# Altium schematic sheet 08_SAMA7G54-PIO.SchDoc
size 420 x 297 mm; SheetNumber: 15; SheetTotal: 33
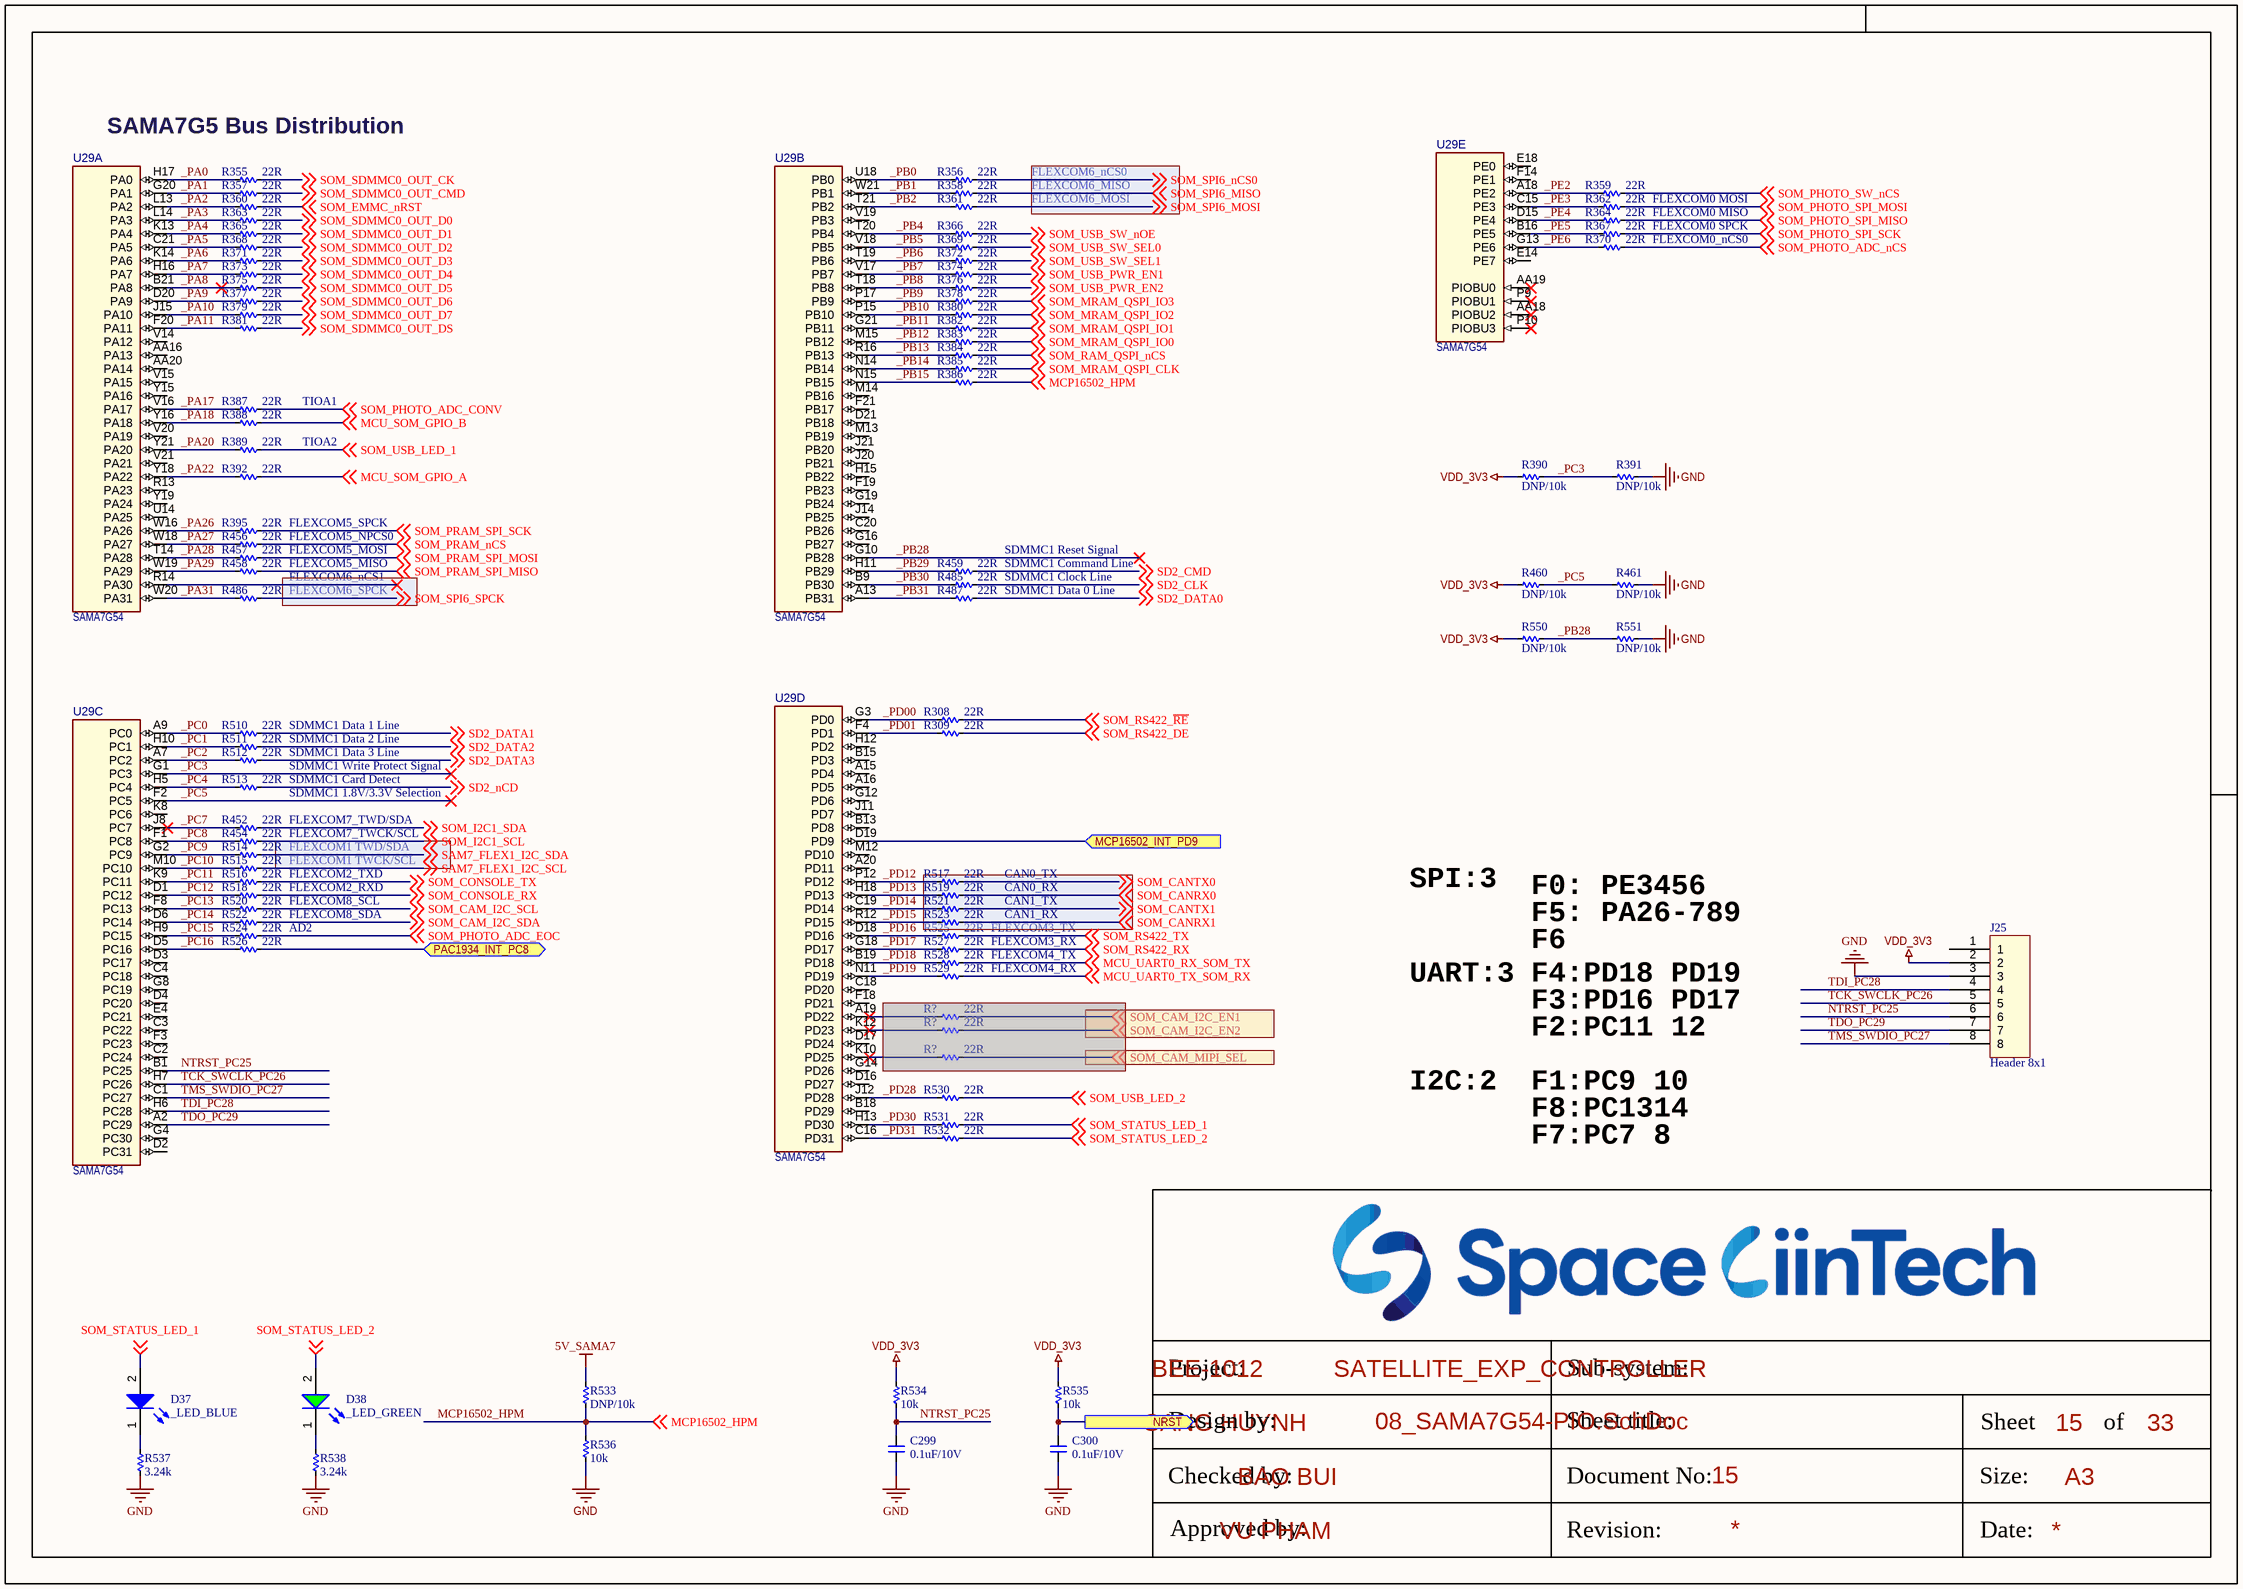
[diagram p0: 08_SAMA7G54-PIO.SchDoc]

## Parts
(Parts that share a designator on the sheet are numbered #1, #2 ... from top to bottom, then left to right.)
C299  0.1uF/10V  [CAP_C_0603x30]
C300  0.1uF/10V  [CAP_C_0603x30]
D37  _LED_BLUE  [LED_0402]
D38  _LED_GREEN  [LED_0402]
J25  Header 8x1  [SAMTEC_TSM-108-01-L-SV-P-TR]
R308  22R  [RES_C_0603X30]
R309  22R  [RES_C_0603X30]
R355  22R  [RES_C_0603X30]
R356  22R  [RES_C_0603X30]
R357  22R  [RES_C_0603X30]
R358  22R  [RES_C_0603X30]
R359  22R  [RES_C_0603X30]
R360  22R  [RES_C_0603X30]
R361  22R  [RES_C_0603X30]
R362  22R  [RES_C_0603X30]
R363  22R  [RES_C_0603X30]
R364  22R  [RES_C_0603X30]
R365  22R  [RES_C_0603X30]
R366  22R  [RES_C_0603X30]
R367  22R  [RES_C_0603X30]
R368  22R  [RES_C_0603X30]
R369  22R  [RES_C_0603X30]
R370  22R  [RES_C_0603X30]
R371  22R  [RES_C_0603X30]
R372  22R  [RES_C_0603X30]
R373  22R  [RES_C_0603X30]
R374  22R  [RES_C_0603X30]
R375  22R  [RES_C_0603X30]
R376  22R  [RES_C_0603X30]
R377  22R  [RES_C_0603X30]
R378  22R  [RES_C_0603X30]
R379  22R  [RES_C_0603X30]
R380  22R  [RES_C_0603X30]
R381  22R  [RES_C_0603X30]
R382  22R  [RES_C_0603X30]
R383  22R  [RES_C_0603X30]
R384  22R  [RES_C_0603X30]
R385  22R  [RES_C_0603X30]
R386  22R  [RES_C_0603X30]
R387  22R  [RES_C_0603X30]
R388  22R  [RES_C_0603X30]
R389  22R  [RES_C_0603X30]
R390  DNP/10k  [RES_C_0603X30]
R391  DNP/10k  [RES_C_0603X30]
R392  22R  [RES_C_0603X30]
R395  22R  [RES_C_0603X30]
R452  22R  [RES_C_0603X30]
R454  22R  [RES_C_0603X30]
R456  22R  [RES_C_0603X30]
R457  22R  [RES_C_0603X30]
R458  22R  [RES_C_0603X30]
R459  22R  [RES_C_0603X30]
R460  DNP/10k  [RES_C_0603X30]
R461  DNP/10k  [RES_C_0603X30]
R485  22R  [RES_C_0603X30]
R486  22R  [RES_C_0603X30]
R487  22R  [RES_C_0603X30]
R510  22R  [RES_C_0603X30]
R511  22R  [RES_C_0603X30]
R512  22R  [RES_C_0603X30]
R513  22R  [RES_C_0603X30]
R514  22R  [RES_C_0603X30]
R515  22R  [RES_C_0603X30]
R516  22R  [RES_C_0603X30]
R517  22R  [RES_C_0603X30]
R518  22R  [RES_C_0603X30]
R519  22R  [RES_C_0603X30]
R520  22R  [RES_C_0603X30]
R521  22R  [RES_C_0603X30]
R522  22R  [RES_C_0603X30]
R523  22R  [RES_C_0603X30]
R524  22R  [RES_C_0603X30]
R525  22R  [RES_C_0603X30]
R526  22R  [RES_C_0603X30]
R527  22R  [RES_C_0603X30]
R528  22R  [RES_C_0603X30]
R529  22R  [RES_C_0603X30]
R530  22R  [RES_C_0603X30]
R531  22R  [RES_C_0603X30]
R532  22R  [RES_C_0603X30]
R533  DNP/10k  [RES_C_0603X30]
R534  10k  [RES_C_0603X30]
R535  10k  [RES_C_0603X30]
R536  10k  [RES_C_0603X30]
R537  3.24k  [RES_C_1005x30_L]
R538  3.24k  [RES_C_1005x30_L]
R550  DNP/10k  [RES_C_0603X30]
R551  DNP/10k  [RES_C_0603X30]
R?#1  22R  [RES_C_0603X30]  (masked out: inside a compile mask, not in the netlist)
R?#2  22R  [RES_C_0603X30]  (masked out: inside a compile mask, not in the netlist)
R?#3  22R  [RES_C_0603X30]  (masked out: inside a compile mask, not in the netlist)
U29  SAMA7G54  [TFBGA-343_14x14 - 2.5mm]  (parts A,B,C,D,E of 8)

## Ports
MCP16502_INT_PD9 (in), NRST (out), PAC1934_INT_PC8 (bidir)

## Nets
5V_SAMA7: R533.1
GND: C299.1 C300.1 J25.3 R391.1 R461.1 R536.2 R537.2 R538.2 R551.1
VDD_3V3: J25.2 R390.2 R460.2 R534.2 R535.2 R550.2
_PA0: R355.2 U29.H17(PA0)
_PA1: R357.2 U29.G20(PA1)
_PA2: R360.2 U29.L13(PA2)
_PA3: R363.2 U29.L14(PA3)
_PA4: R365.2 U29.K13(PA4)
_PA5: R368.2 U29.C21(PA5)
_PA6: R371.2 U29.K14(PA6)
_PA7: R373.2 U29.H16(PA7)
_PA8: R375.2 U29.B21(PA8)
_PA9: R377.2 U29.D20(PA9)
_PA10: R379.2 U29.J15(PA10)
_PA11: R381.2 U29.F20(PA11)
_PA17: R387.2 U29.V16(PA17)
_PA18: R388.2 U29.Y16(PA18)
_PA20: R389.2 U29.Y21(PA20)
_PA22: R392.2 U29.Y18(PA22)
_PA26: R395.2 U29.W16(PA26)
_PA27: R456.2 U29.W18(PA27)
_PA28: R457.2 U29.T14(PA28)
_PA29: R458.2 U29.W19(PA29)
_PA31: R486.2 U29.W20(PA31)
_PB0: R356.2 U29.U18(PB0)
_PB1: R358.2 U29.W21(PB1)
_PB2: R361.2 U29.T21(PB2)
_PB4: R366.2 U29.T20(PB4)
_PB5: R369.2 U29.V18(PB5)
_PB6: R372.2 U29.T19(PB6)
_PB7: R374.2 U29.V17(PB7)
_PB8: R376.2 U29.T18(PB8)
_PB9: R378.2 U29.P17(PB9)
_PB10: R380.2 U29.P15(PB10)
_PB11: R382.2 U29.G21(PB11)
_PB12: R383.2 U29.M15(PB12)
_PB13: R384.2 U29.R16(PB13)
_PB14: R385.2 U29.N14(PB14)
_PB15: R386.2 U29.N15(PB15)
_PB28: R550.1 R551.2 U29.G10(PB28)
_PB29: R459.2 U29.H11(PB29)
_PB30: R485.2 U29.B9(PB30)
_PB31: R487.2 U29.A13(PB31)
_PC0: R510.2 U29.A9(PC0)
_PC1: R511.2 U29.H10(PC1)
_PC2: R512.2 U29.A7(PC2)
_PC3: R390.1 R391.2 U29.G1(PC3)
_PC4: R513.2 U29.H5(PC4)
_PC5: R460.1 R461.2 U29.F2(PC5)
_PC7: R452.2 U29.J8(PC7)
_PC8: R454.2 U29.F1(PC8)
_PC9: R514.2 U29.G2(PC9)
_PC10: R515.2 U29.M10(PC10)
_PC11: R516.2 U29.K9(PC11)
_PC12: R518.2 U29.D1(PC12)
_PC13: R520.2 U29.F8(PC13)
_PC14: R522.2 U29.D6(PC14)
_PC15: R524.2 U29.H9(PC15)
_PC16: R526.2 U29.D5(PC16)
_PD00: R308.2 U29.G3(PD0)
_PD01: R309.2 U29.F4(PD1)
_PD12: R517.2 U29.P12(PD12)
_PD13: R519.2 U29.H18(PD13)
_PD14: R521.2 U29.C19(PD14)
_PD15: R523.2 U29.R12(PD15)
_PD16: R525.2 U29.D18(PD16)
_PD17: R527.2 U29.G18(PD17)
_PD18: R528.2 U29.B19(PD18)
_PD19: R529.2 U29.N11(PD19)
_PD28: R530.2 U29.J12(PD28)
_PD30: R531.2 U29.H13(PD30)
_PD31: R532.2 U29.C16(PD31)
_PE2: R359.2 U29.A18(PE2)
_PE3: R362.2 U29.C15(PE3)
_PE4: R364.2 U29.D15(PE4)
_PE5: R367.2 U29.B16(PE5)
_PE6: R370.2 U29.G13(PE6)
MCP16502_HPM: R386.1 R533.2 R536.1 ; off-sheet MCP16502_HPM
MCP16502_INT_PD9: U29.D19(PD9) ; port MCP16502_INT_PD9
MCU_SOM_GPIO_A: R392.1 ; off-sheet MCU_SOM_GPIO_A
MCU_SOM_GPIO_B: R388.1 ; off-sheet MCU_SOM_GPIO_B
MCU_UART0_RX_SOM_TX: R528.1 ; off-sheet MCU_UART0_RX_SOM_TX
MCU_UART0_TX_SOM_RX: R529.1 ; off-sheet MCU_UART0_TX_SOM_RX
NRST: C300.2 R535.1 ; port NRST
NTRST_PC25: C299.2 J25.6 R534.1 U29.B1(PC25)
PAC1934_INT_PC8: R526.1 ; port PAC1934_INT_PC8
SAM7_FLEX1_I2C_SCL: R515.1 ; off-sheet SAM7_FLEX1_I2C_SCL
SAM7_FLEX1_I2C_SDA: R514.1 ; off-sheet SAM7_FLEX1_I2C_SDA
SD2_CLK: R485.1 ; off-sheet SD2_CLK
SD2_CMD: R459.1 ; off-sheet SD2_CMD
SD2_DATA0: R487.1 ; off-sheet SD2_DATA0
SD2_DATA1: R510.1 ; off-sheet SD2_DATA1
SD2_DATA2: R511.1 ; off-sheet SD2_DATA2
SD2_DATA3: R512.1 ; off-sheet SD2_DATA3
SD2_nCD: R513.1 ; off-sheet SD2_nCD
SOM_CAM_I2C_SCL: R520.1 ; off-sheet SOM_CAM_I2C_SCL
SOM_CAM_I2C_SDA: R522.1 ; off-sheet SOM_CAM_I2C_SDA
SOM_CANRX0: R519.1 ; off-sheet SOM_CANRX0
SOM_CANRX1: R523.1 ; off-sheet SOM_CANRX1
SOM_CANTX0: R517.1 ; off-sheet SOM_CANTX0
SOM_CANTX1: R521.1 ; off-sheet SOM_CANTX1
SOM_CONSOLE_RX: R518.1 ; off-sheet SOM_CONSOLE_RX
SOM_CONSOLE_TX: R516.1 ; off-sheet SOM_CONSOLE_TX
SOM_EMMC_nRST: R360.1 ; off-sheet SOM_EMMC_nRST
SOM_I2C1_SCL: R454.1 ; off-sheet SOM_I2C1_SCL
SOM_I2C1_SDA: R452.1 ; off-sheet SOM_I2C1_SDA
SOM_MRAM_QSPI_CLK: R385.1 ; off-sheet SOM_MRAM_QSPI_CLK
SOM_MRAM_QSPI_IO0: R383.1 ; off-sheet SOM_MRAM_QSPI_IO0
SOM_MRAM_QSPI_IO1: R382.1 ; off-sheet SOM_MRAM_QSPI_IO1
SOM_MRAM_QSPI_IO2: R380.1 ; off-sheet SOM_MRAM_QSPI_IO2
SOM_MRAM_QSPI_IO3: R378.1 ; off-sheet SOM_MRAM_QSPI_IO3
SOM_PHOTO_ADC_CONV: R387.1 ; off-sheet SOM_PHOTO_ADC_CONV
SOM_PHOTO_ADC_EOC: R524.1 ; off-sheet SOM_PHOTO_ADC_EOC
SOM_PHOTO_ADC_nCS: R370.1 ; off-sheet SOM_PHOTO_ADC_nCS
SOM_PHOTO_SPI_MISO: R364.1 ; off-sheet SOM_PHOTO_SPI_MISO
SOM_PHOTO_SPI_MOSI: R362.1 ; off-sheet SOM_PHOTO_SPI_MOSI
SOM_PHOTO_SPI_SCK: R367.1 ; off-sheet SOM_PHOTO_SPI_SCK
SOM_PHOTO_SW_nCS: R359.1 ; off-sheet SOM_PHOTO_SW_nCS
SOM_PRAM_nCS: R456.1 ; off-sheet SOM_PRAM_nCS
SOM_PRAM_SPI_MISO: R458.1 ; off-sheet SOM_PRAM_SPI_MISO
SOM_PRAM_SPI_MOSI: R457.1 ; off-sheet SOM_PRAM_SPI_MOSI
SOM_PRAM_SPI_SCK: R395.1 ; off-sheet SOM_PRAM_SPI_SCK
SOM_RAM_QSPI_nCS: R384.1 ; off-sheet SOM_RAM_QSPI_nCS
SOM_RS422_DE: R309.1 ; off-sheet SOM_RS422_DE
SOM_RS422_~{RE}: R308.1 ; off-sheet SOM_RS422_~{RE}
SOM_RS422_RX: R527.1 ; off-sheet SOM_RS422_RX
SOM_RS422_TX: R525.1 ; off-sheet SOM_RS422_TX
SOM_SDMMC0_OUT_CK: R355.1 ; off-sheet SOM_SDMMC0_OUT_CK
SOM_SDMMC0_OUT_CMD: R357.1 ; off-sheet SOM_SDMMC0_OUT_CMD
SOM_SDMMC0_OUT_D0: R363.1 ; off-sheet SOM_SDMMC0_OUT_D0
SOM_SDMMC0_OUT_D1: R365.1 ; off-sheet SOM_SDMMC0_OUT_D1
SOM_SDMMC0_OUT_D2: R368.1 ; off-sheet SOM_SDMMC0_OUT_D2
SOM_SDMMC0_OUT_D3: R371.1 ; off-sheet SOM_SDMMC0_OUT_D3
SOM_SDMMC0_OUT_D4: R373.1 ; off-sheet SOM_SDMMC0_OUT_D4
SOM_SDMMC0_OUT_D5: R375.1 ; off-sheet SOM_SDMMC0_OUT_D5
SOM_SDMMC0_OUT_D6: R377.1 ; off-sheet SOM_SDMMC0_OUT_D6
SOM_SDMMC0_OUT_D7: R379.1 ; off-sheet SOM_SDMMC0_OUT_D7
SOM_SDMMC0_OUT_DS: R381.1 ; off-sheet SOM_SDMMC0_OUT_DS
SOM_SPI6_MISO: R358.1 ; off-sheet SOM_SPI6_MISO
SOM_SPI6_MOSI: R361.1 ; off-sheet SOM_SPI6_MOSI
SOM_SPI6_nCS0: R356.1 ; off-sheet SOM_SPI6_nCS0
SOM_SPI6_SPCK: R486.1 ; off-sheet SOM_SPI6_SPCK
SOM_STATUS_LED_1: D37.2(A) R531.1 ; off-sheet SOM_STATUS_LED_1
SOM_STATUS_LED_2: D38.2(A) R532.1 ; off-sheet SOM_STATUS_LED_2
SOM_USB_LED_1: R389.1 ; off-sheet SOM_USB_LED_1
SOM_USB_LED_2: R530.1 ; off-sheet SOM_USB_LED_2
SOM_USB_PWR_EN1: R374.1 ; off-sheet SOM_USB_PWR_EN1
SOM_USB_PWR_EN2: R376.1 ; off-sheet SOM_USB_PWR_EN2
SOM_USB_SW_nOE: R366.1 ; off-sheet SOM_USB_SW_nOE
SOM_USB_SW_SEL0: R369.1 ; off-sheet SOM_USB_SW_SEL0
SOM_USB_SW_SEL1: R372.1 ; off-sheet SOM_USB_SW_SEL1
TCK_SWCLK_PC26: J25.5 U29.H7(PC26)
TDI_PC28: J25.4 U29.H6(PC28)
TDO_PC29: J25.7 U29.A2(PC29)
TMS_SWDIO_PC27: J25.8 U29.C1(PC27)
NetD37_1: D37.1(K) R537.1
NetD38_1: D38.1(K) R538.1

Not connected (* = marked no-connect by the designer): J25 1; U29 A15(PD4) A16(PD5) A19(PD22)* A20(PD11) AA16(PA13) AA18(PIOBU2)* AA19(PIOBU0)* AA20(PA14) B13(PD8) B15(PD3) B18(PD29) C2(PC24) C3(PC22) C4(PC18) C18(PD20) C20(PB26) D2(PC31) D3(PC17) D4(PC20) D16(PD27) D17(PD24) D21(PB18) E4(PC21) E14(PE7) E18(PE0) F3(PC23) F14(PE1) F18(PD21) F19(PB23) F21(PB17) G4(PC30) G8(PC19) G12(PD6) G14(PD26) G16(PB27) G19(PB24) H12(PD2) H15(PB22) J11(PD7) J14(PB25) J20(PB21) J21(PB20) K8(PC6) K10(PD25)* K12(PD23)* M12(PD10) M13(PB19) M14(PB16) P9(PIOBU1)* P10(PIOBU3)* R13(PA23) R14(PA30)* U14(PA25) V14(PA12) V15(PA15) V19(PB3) V20(PA19) V21(PA21) Y15(PA16) Y19(PA24)

## Notes on the sheet
- SAMA7G5 Bus Distribution
- FLEXCOM6_MISO
- FLEXCOM6_nCS0
- FLEXCOM6_MOSI
- FLEXCOM0 MISO
- FLEXCOM0_nCS0
- FLEXCOM0 SPCK
- FLEXCOM0 MOSI
- TIOA1
- TIOA2
- FLEXCOM5_SPCK
- FLEXCOM6_SPCK
- FLEXCOM6_nCS1
- FLEXCOM5_NPCS0
- FLEXCOM5_MOSI
- FLEXCOM5_MISO
- SDMMC1 Reset Signal
- SDMMC1 Command Line
- SDMMC1 Data 0 Line
- SDMMC1 Clock Line
- SDMMC1 Data 1 Line
- SDMMC1 Data 2 Line
- SDMMC1 Data 3 Line
- SDMMC1 Write Protect Signal
- SDMMC1 Card Detect
- SDMMC1 1.8V/3.3V Selection
- FLEXCOM1 TWD/SDA
- FLEXCOM1 TWCK/SCL
- FLEXCOM7_TWD/SDA
- FLEXCOM7_TWCK/SCL
- AD2
- FLEXCOM8_SCL
- FLEXCOM8_SDA
- FLEXCOM2_TXD
- FLEXCOM2_RXD
- FLEXCOM3_TX
- CAN0_TX
- CAN0_RX
- CAN1_TX
- CAN1_RX
- SPI:3
- F0: PE3456
- F5: PA26-789
- FLEXCOM3_RX
- FLEXCOM4_TX
- FLEXCOM4_RX
- UART:3
- F4:PD18 PD19
- F6
- F3:PD16 PD17
- F2:PC11 12
- I2C:2
- F1:PC9 10
- F8:PC1314
- F7:PC7 8
- Project:
- BEE-1012
- Sub-system:
- SATELLITE_EXP_CONTROLLER
- Design by:
- SANG HUYNH
- BAO BUI
- Sheet title:
- Sheet
- A3
- of
- Checked by:
- Approved by:
- VU PHAM
- Revision:
- Document No:
- Size:
- Date:

## Library data of the parts
C299 C300 = _CAP_C_2: CAP
R308 R309 R355-R392 R395 R452 R454 R456-R461 R485-R487 R510-R538 R550 R551 R?#1-R?#3 = _RES_B_2: RES
U29 = SAMA7G54: SAMA7G54 MPU 1000MHz Cortex-A7 TFBGA-343; Manufacturer Part Number 1: SAMA7G54-V/4HB; Manufacturer 1: Microchip; Description_: MCHP MPU 32-BIT Cortex-A7 1000MHz 128kB SAMA7G54-V/4HB TFBGA-343; Populated: YES; MCHP-ID: MIC8923; Symbol: SAMA7G54 TFBGA-343; Dev Tools Status: Design; Owner: Ciprian Abramov; Package: TFBGA-343; Value: SAMA7G54; Type: 32-Bit MPU; Status: MCL Design; Revision: 1; Category: MCHP-Microcontroller; ComponentLink1Description: SVN Datasheet; ComponentLink2Description: Local Datasheet; ComponentLink3URL: C:\ALTIUM_WORK\00001_MCHP-CDB\Library\LibraryRefs\SAMA7G54 TFBGA-343.SchLib; ComponentLink3Description: Open Symbol; ComponentLink4URL: C:\ALTIUM_WORK\00001_MCHP-CDB\Library\Footprints\TFBGA-343_14x14.PcbLib; ComponentLink4Description: Open Footprint; ComponentLink5Description: Open Footprint 2; ComponentLink6Description: Open Footprint 3; ComponentLink7Description: Open Footprint 4; Supplier 1: Microchip; Supplier Part Number 1: SAMA7G54-V/4HB; Quantity Override: 1